# EAGLE design RFM50_to_IWING-MRF_2 (EAGLE 6.5.0)
Shield Board for RFM50 Breakout-Board Making a RFM50 breakout board be compatibled with IWING-MRF board.
AUTHOR: Pasakorn Tiwatthanont
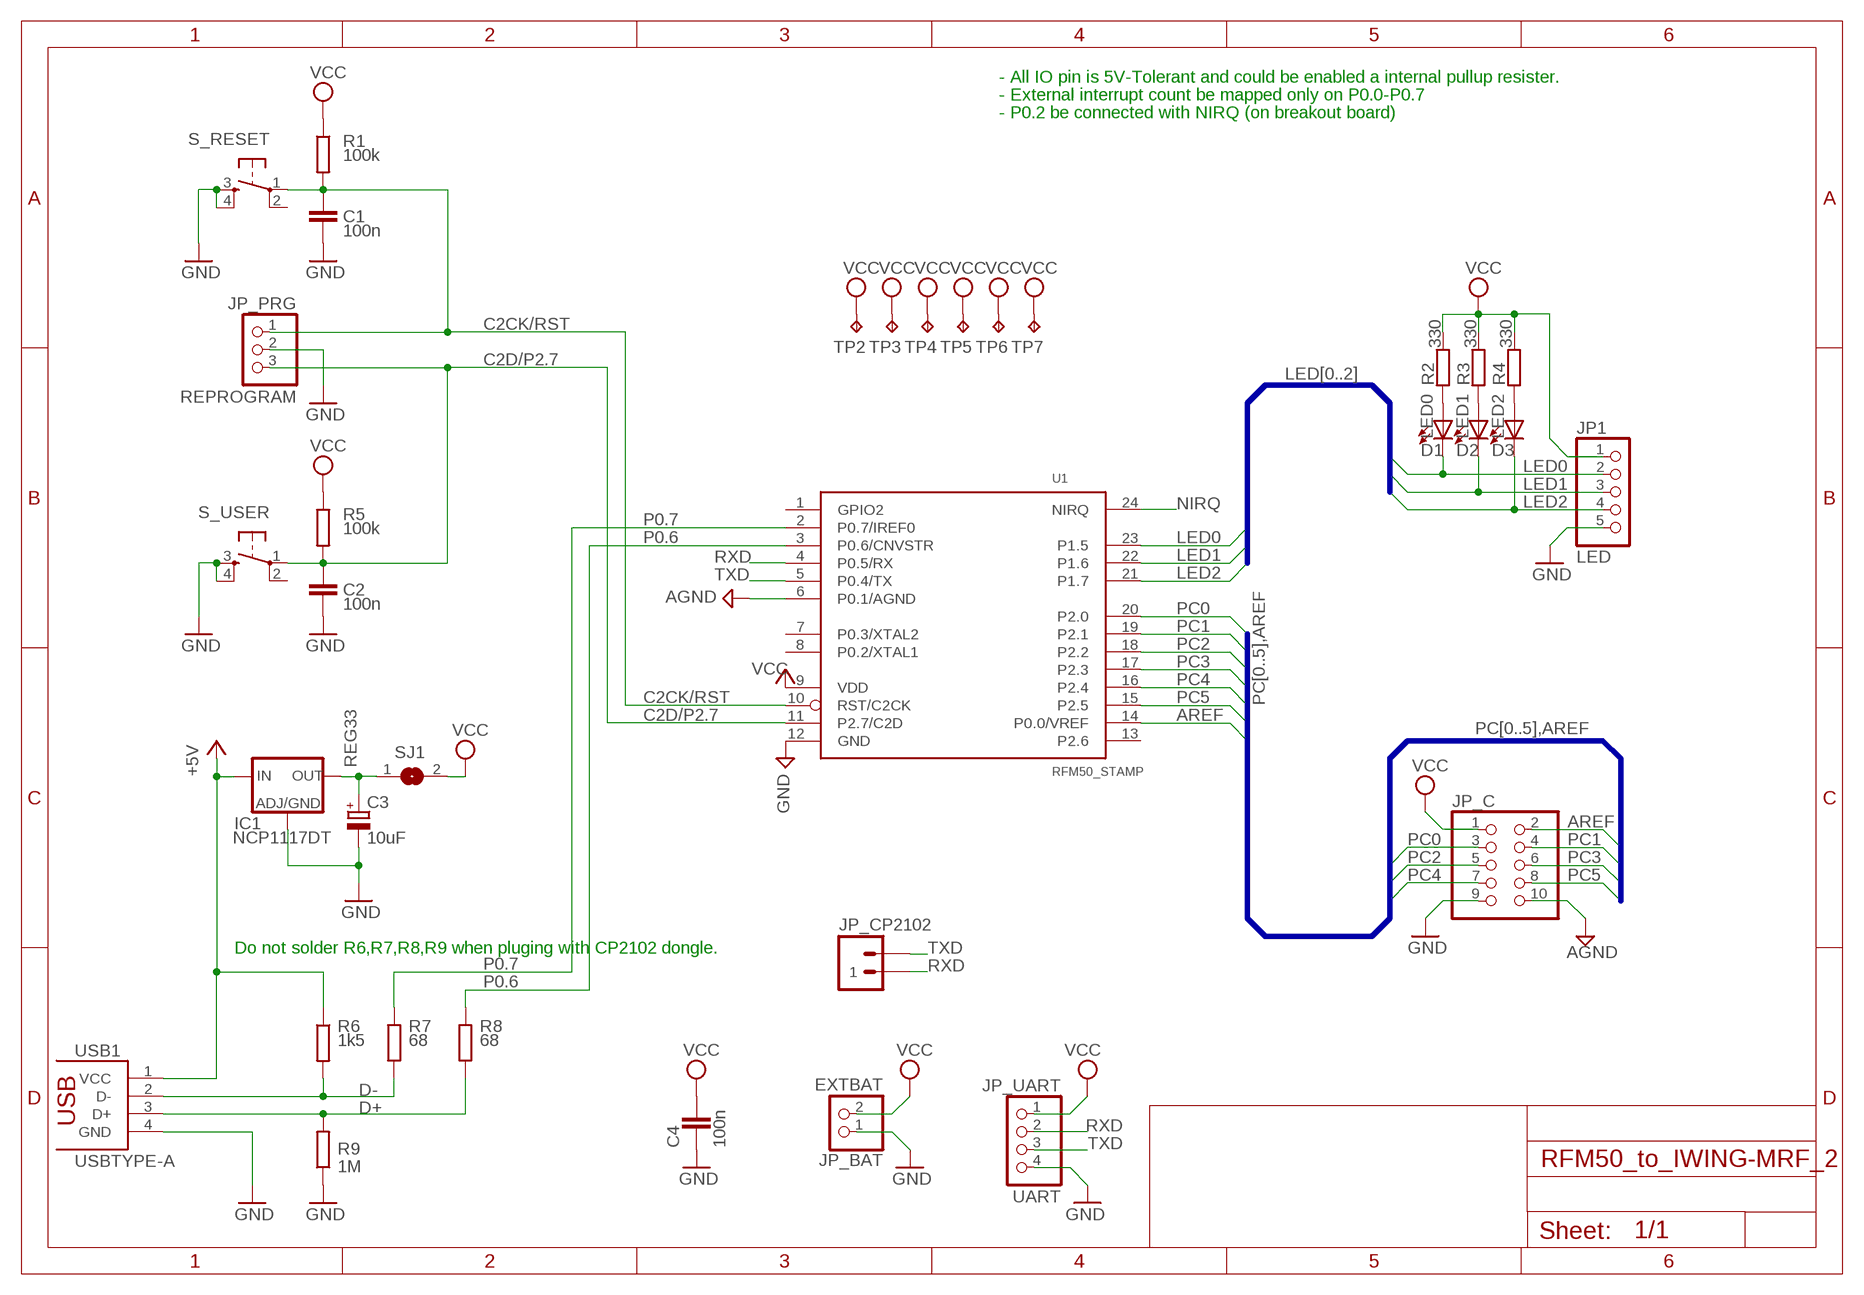
[diagram p0: schematic, sheet 1]

## Parts
C1  100n  C-EU050-024X044  [C050-024X044]
C2  100n  C-EU050-024X044  [C050-024X044]
C3  10uF  CPOL-EUE2,5-6E  [E2,5-6E]
C4  100n  C-EU050-024X044  [C050-024X044]
D1  LED0  LED3MM  [LED3MM]
D2  LED1  LED3MM  [LED3MM]
D3  LED2  LED3MM  [LED3MM]
IC1  NCP1117DT  [DPACK]
JP1  LED  PINHD-1X5  [1X05]
JP_BAT  EXTBAT  PINHD-1X2  [1X02]
JP_C  HEADER-2X5  [2X05]
JP_CP2102  M02PTH  [1X02]
JP_PRG  REPROGRAM  PINHD-1X3  [1X03]
JP_UART  UART  HEADER-1X4ROUND  [1X04_ROUND]
R1  100k  R-EU_0204/5  [0204/5]
R2  330  R-EU_0204/5  [0204/5]
R3  330  R-EU_0204/5  [0204/5]
R4  330  R-EU_0204/5  [0204/5]
R5  100k  R-EU_0204/5  [0204/5]
R6  1k5  R-EU_0204/5  [0204/5]
R7  68  R-EU_0204/5  [0204/5]
R8  68  R-EU_0204/5  [0204/5]
R9  1M  R-EU_0204/5  [0204/5]
S_RESET  DTS-6  [DTS-6]
S_USER  DTS-6  [DTS-6]
SJ1  SOLDERJUMPERREFLOW_NOPASTE  [SOLDERJUMPER_REFLOW_NOPASTE]
TP2  TPPAD1-10  [P1-10_TP]
TP3  TPPAD1-10  [P1-10_TP]
TP4  TPPAD1-10  [P1-10_TP]
TP5  TPPAD1-10  [P1-10_TP]
TP6  TPPAD1-10  [P1-10_TP]
TP7  TPPAD1-10  [P1-10_TP]
U1  RFM50_STAMP  [RFM50_STAMP]
USB1  USBTYPE-A  [USBTYPE-A]

## Nets
+5V: IC1.3(IN) R6.1 USB1.1(VCC)
AGND: JP_C.10 U1.6(P0.1/AGND)
AREF: JP_C.2 U1.14(P0.0/VREF)
C2CK/RST: C1.2 JP_PRG.1 R1.2 S_RESET.1 U1.10(RST/C2CK)
C2D/P2.7: C2.2 JP_PRG.3 R5.2 S_USER.1 U1.11(P2.7/C2D)
D+: R8.1 R9.2 USB1.3(D+)
D-: R6.2 R7.1 USB1.2(D-)
GND [power]: C1.1 C2.1 C3.- C4.1 IC1.1(ADJ) JP1.5 JP_BAT.1 JP_C.9 JP_PRG.2 JP_UART.4 R9.1 S_RESET.3 S_RESET.4 S_USER.3 S_USER.4 U1.12(GND) USB1.4(GND)
LED0: D1.K(C) JP1.2 U1.23(P1.5)
LED1: D2.K(C) JP1.3 U1.22(P1.6)
LED2: D3.K(C) JP1.4 U1.21(P1.7)
N$1: D1.A R2.2
N$7: D2.A R3.2
N$8: D3.A R4.2
NIRQ: U1.24(NIRQ)
P0.6: R8.2 U1.3(P0.6/CNVSTR)
P0.7: R7.2 U1.2(P0.7/IREF0)
PC0: JP_C.3 U1.20(P2.0)
PC1: JP_C.4 U1.19(P2.1)
PC2: JP_C.5 U1.18(P2.2)
PC3: JP_C.6 U1.17(P2.3)
PC4: JP_C.7 U1.16(P2.4)
PC5: JP_C.8 U1.15(P2.5)
REG33 [power]: C3.+ IC1.4(OUT) SJ1.1
RXD: JP_CP2102.1 JP_UART.2 U1.4(P0.5/RX)
TXD: JP_CP2102.2 JP_UART.3 U1.5(P0.4/TX)
VCC [power]: C4.2 JP1.1 JP_BAT.2 JP_C.1 JP_UART.1 R1.1 R2.1 R3.1 R4.1 R5.1 SJ1.2 TP2.TP TP3.TP TP4.TP TP5.TP TP6.TP TP7.TP U1.9(VDD)
Unconnected: S_RESET.2 S_USER.2 U1.1(GPIO2) U1.7(P0.3/XTAL2) U1.8(P0.2/XTAL1) U1.13(P2.6)

## Buses
PC[0..5],AREF
LED[0..2]

## Notes on the sheet
- - All IO pin is 5V-Tolerant and could be enabled a internal pullup resister.
- - External interrupt count be mapped only on P0.0-P0.7
- - P0.2 be connected with NIRQ (on breakout board)
- Do not solder R6,R7,R8,R9 when pluging with CP2102 dongle.

## Library data of the parts
C1 C2 C4 = rcl:C-EU: CAPACITOR, European symbol
C3 = rcl:CPOL-EU: POLARIZED CAPACITOR, European symbol
D1-D3 = led:LED: LED OSRAM: - CHIPLED LG R971, LG N971, LY N971, LG Q971, LY Q971, LO R971, LY R971 LH N974, LH R974 LS Q976, LO Q976, LY Q976 LO Q996 - Hyper CHIPLED LW Q18S LB Q993, LB Q99A, LB R99A - SideLED LS A670, LO A670, LY A670, LG A670, LP A670 LB A673, LV A673, LT A673, LW A673 LH A674 LY A675 LS A676, LA A676, LO A676, LY A676, LW A676 LS A679, LY A679, LG A679 - Hyper Micro SIDELED® LS Y876, LA Y876, LO Y876, LY Y876 LT Y87S - SmartLED LW L88C, LW L88S LB L89C, LB L89S, LG L890 LS L89K, LO L89K, LY L89K LS L896, LA L896, LO L896, LY L896 - TOPLED LS T670, LO T670, LY T670, LG T670, LP T670 LSG T670, LSP T670, LSY T670, LOP T670, LYG T670 LG T671, LOG T671, LSG T671 LB T673, LV T673, LT T673, LW T673 LH T674 LS T676, LA T676, LO T676, LY T676, LB T676, LH T676, LSB T676, LW T676 LB T67C, LV T67C, LT T67C, LS T67K, LO T67K, LY T67K, LW E67C LS E67B, LA E67B, LO E67B, LY E67B, LB E67C, LV E67C, LT E67C LW T67C LS T679, LY T679, LG T679 LS T770, LO T770, LY T770, LG T770, LP T770 LB T773, LV T773, LT T773, LW T773 LH T774 LS E675, LA E675, LY E675, LS T675 LS T776, LA T776, LO T776, LY T776, LB T776 LHGB T686 LT T68C, LB T68C - Hyper Mini TOPLED® LB M676 - Mini TOPLED Santana® LG M470 LS M47K, LO M47K, LY M47K Source: http://www.osram.convergy.de LUXEON: - LUMILED® LXK2-PW12-R00, LXK2-PW12-S00, LXK2-PW14-U00, LXK2-PW14-V00 LXK2-PM12-R00, LXK2-PM12-S00, LXK2-PM14-U00 LXK2-PE12-Q00, LXK2-PE12-R00, LXK2-PE12-S00, LXK2-PE14-T00, LXK2-PE14-U00 LXK2-PB12-K00, LXK2-PB12-L00, LXK2-PB12-M00, LXK2-PB14-N00, LXK2-PB14-P00, LXK2-PB14-Q00 LXK2-PR12-L00, LXK2-PR12-M00, LXK2-PR14-Q00, LXK2-PR14-R00 LXK2-PD12-Q00, LXK2-PD12-R00, LXK2-PD12-S00 LXK2-PH12-R00, LXK2-PH12-S00 LXK2-PL12-P00, LXK2-PL12-Q00, LXK2-PL12-R00 Source: www.luxeon.com KINGBRIGHT: KA-3528ASYC Source: www.kingbright.com
IC1 = iwing-mrf:NCP1117: Low drop-out positive fixed and adjustable voltage regulator
JP1 = ipas:PINHD-1X5: PIN HEADER
JP_BAT = pinhead:PINHD-1X2: PIN HEADER
JP_C = microbuilder:HEADER-2X5: PIN HEADER
JP_CP2102 = ipas:M02: Header 2 Standard 2-pin 0.1" header. Use with straight break away headers (SKU : PRT-00116), right angle break away headers (PRT-00553), swiss pins (PRT-00743), machine pins (PRT-00117), and female headers (PRT-00115). Molex polarized connector foot print use with SKU : PRT-08233 with associated crimp pins and housings.
JP_PRG = pinhead:PINHD-1X3: PIN HEADER
JP_UART = microbuilder:HEADER-1X4: PIN HEADER
R1-R9 = rcl:R-EU_: RESISTOR, European symbol
S_RESET S_USER = switch-tact:DTS-6
SJ1 = ipas:SOLDERJUMPER: SMD Solder JUMPER Solder the two pads together to create a connection, or remove the solder to break it. REFLOW - Use this footprint for solder paste and reflow ovens. WAVE - Use this footprint for hand-soldering (larger pads). CLOSED - Has a trace between the two pads to ensure it is closed by default. The trace needs to be cut to disable the jumper, and can be closed again by creating a solder bridge between the two pads.
TP2-TP7 = ipas:TP: Test pad
U1 = ipas:RFM50_STAMP: RFM50 Stamp Board, placed HopeRF's RFM50, Si1000.
USB1 = USBTYPE-A:USBTYPE-A

## Net classes
0 default: width 0.254 mm, clearance 0.305 mm
1 power: width 0.406 mm, clearance 0.254 mm to class 0, clearance 0.305 mm

## Board
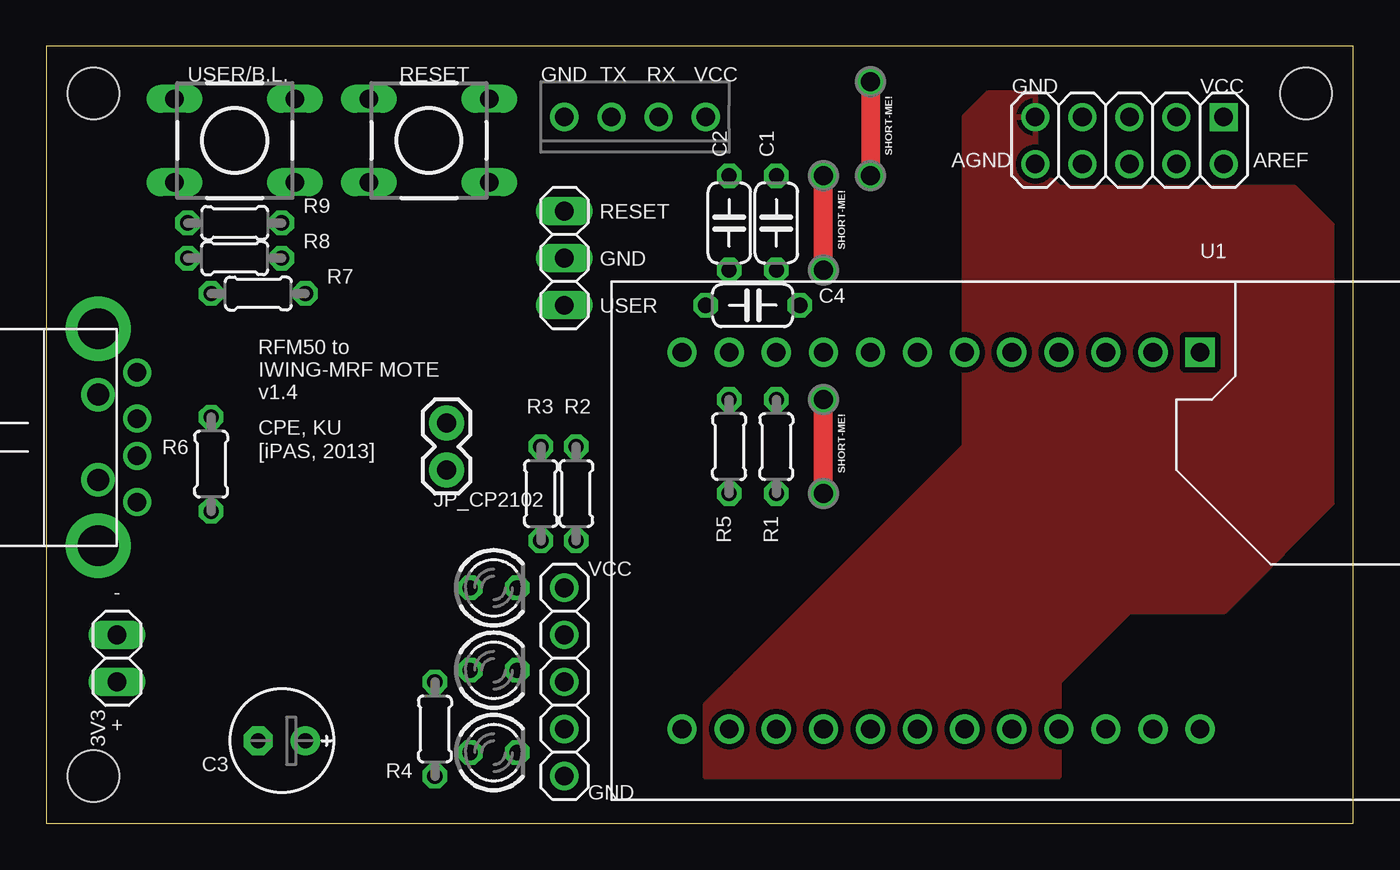
[diagram p1: board, top side]
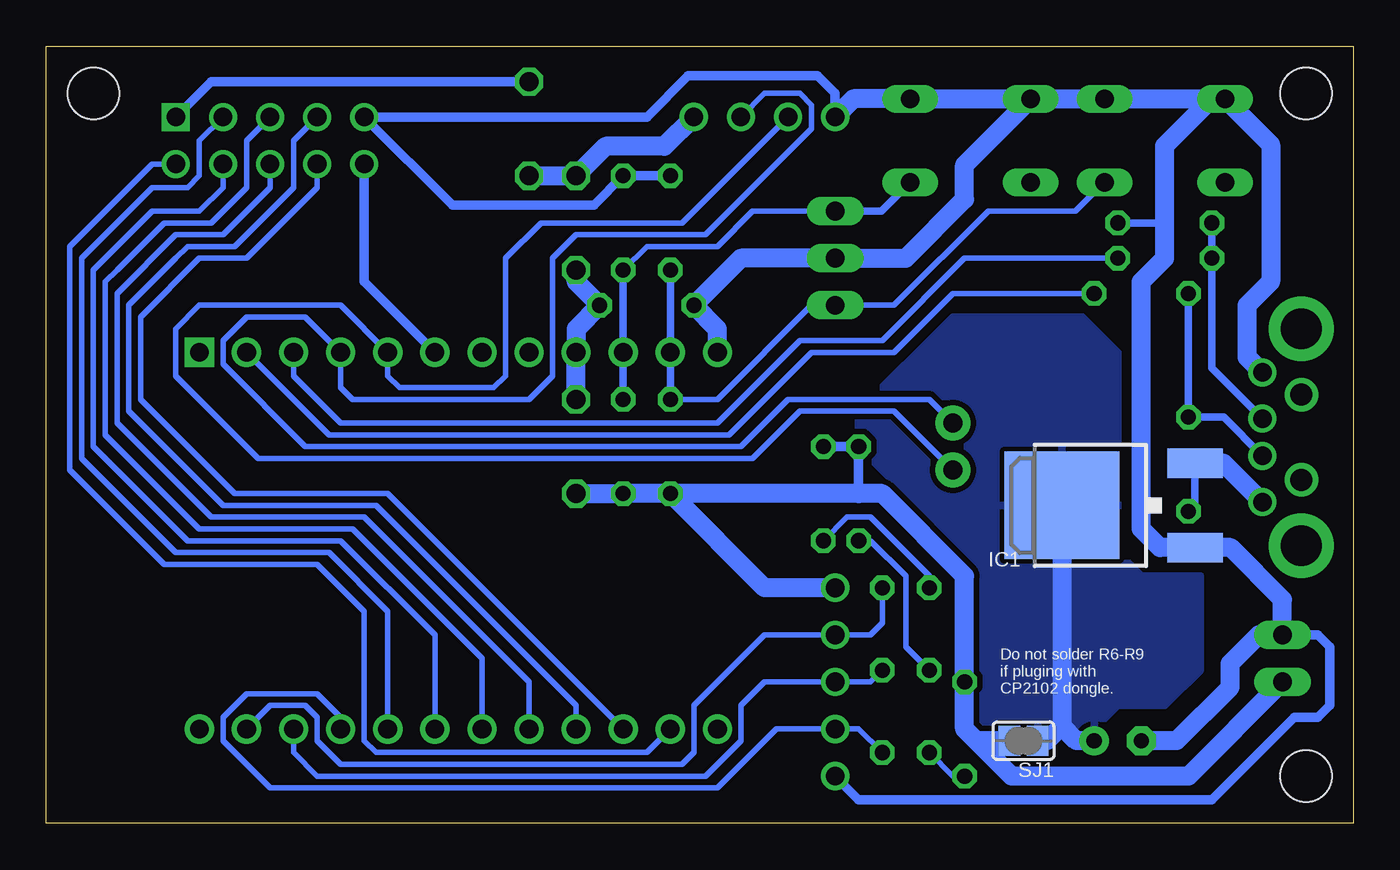
[diagram p2: board, bottom side, seen from below]

Size 70.48 x 41.91 mm. Coordinates in mm from the lower left corner, seen from the top.
Outline: 0,0 70.48,0 70.48,41.91 0,41.91 0,0
Copper layers (1*16): Top 0.035mm / dielectric 1.5mm / Bottom 0.035mm
Design rules "default *": minimum track width 10mil, minimum drill 24mil, track to track 12mil, track to pad 12mil, pad to pad 12mil, via to via 12mil, smd to smd 10mil, copper to edge 40mil, drill to drill 8mil, minimum pad ring 10mil, minimum via ring 8mil, stop-mask expansion 4mil, vias tented up to drill 0mil, thermal gap 10mil
Holes 2.8 mm at 2.54,39.37 2.54,2.54 67.94,39.37

### Footprints (pad centres in the part's own frame; a part is rotated, then mirrored left to right if it is on the bottom)
C050-024X044 = drill 0.813 octagon: 1 -2.54,0; 2 2.54,0
E2,5-6E = drill 0.813 pad 1.575: + -1.27,0 | drill 0.813 pad 1.575 octagon: - 1.27,0
LED3MM = drill 0.813 octagon: A -1.27,0; K 1.27,0
DPACK = smd 1.6 x 3: 1 -2.28,-4.8; 3 2.28,-4.8 | smd 5.8 x 6.2: 4 0,2.38
1X05 = drill 1.016: 1 -5.08,0; 2 -2.54,0; 3 0,0; 4 2.54,0; 5 5.08,0
1X02 = drill 1.016 long: 1 -1.27,0; 2 1.27,0
2X05 = drill 1 square: 1 -5.08,-1.27 | drill 1: 2 -5.08,1.27; 3 -2.54,-1.27; 4 -2.54,1.27; 5 0,-1.27; 6 0,1.27; 7 2.54,-1.27; 8 2.54,1.27; 9 5.08,-1.27; 10 5.08,1.27
1X02' = drill 1.016 pad 1.88: 1 0,0; 2 2.54,0
1X03 = drill 1.016 long: 1 -2.54,0; 2 0,0; 3 2.54,0
1X04_ROUND = drill 1 pad 1.524: 1 -3.81,0; 2 -1.27,0; 3 1.27,0; 4 3.81,0
0204/5 = drill 0.813 octagon: 1 -2.54,0; 2 2.54,0
DTS-6 = drill 1 long: 1 -3.25,2.25; 2 3.25,2.25; 3 -3.25,-2.25; 4 3.25,-2.25
SOLDERJUMPER_REFLOW_NOPASTE = smd 1.168 x 1.6: 1 -0.762,0; 2 0.762,0
P1-10_TP = drill 1.016 octagon: TP 0,0
RFM50_STAMP = drill 1.016 pad 1.575 square: 1 0,27.94 | drill 1.016 pad 1.575: 2 0,25.4; 3 0,22.86; 4 0,20.32; 5 0,17.78; 6 0,15.24; 7 0,12.7; 8 0,10.16; 9 0,7.62; 10 0,5.08; 11 0,2.54; 12 0,0; 13 20.32,0; 14 20.32,2.54; 15 20.32,5.08; 16 20.32,7.62; 17 20.32,10.16; 18 20.32,12.7; 19 20.32,15.24; 20 20.32,17.78; 21 20.32,20.32; 22 20.32,22.86; 23 20.32,25.4; 24 20.32,27.94
USBTYPE-A = drill 1: 1 -2.1,9.35; 2 -2.1,6.85; 3 -2.1,4.85; 4 -2.1,2.35 | drill 2.2 pad 3.5: GND@1 0,0; GND@2 0,11.7 | drill 1.2 pad 1.6: S1 0,3.55; S2 0,8.15

### Placement (x,y rotation side)
C1  39.37,32.38 270 top
C2  36.83,32.38 270 top
C3  12.7,4.45 180 top
C4  38.1,27.94 0 top
D1  24.13,12.7 0 top
D2  24.13,8.26 0 top
D3  24.13,3.81 0 top
IC1  13.34,17.14 90 bottom
JP1  27.94,7.62 270 top
JP_BAT  3.81,8.89 270 top
JP_C  58.42,36.83 180 top
JP_CP2102  [1X02']  21.59,21.59 270 top
JP_PRG  27.94,30.48 270 top
JP_UART  31.75,38.1 180 top
R1  39.37,20.32 90 top
R2  28.57,17.78 270 top
R3  26.67,17.78 270 top
R4  20.95,5.08 270 top
R5  36.83,20.32 90 top
R6  8.89,19.37 90 top
R7  11.43,28.57 0 top
R8  10.16,30.48 0 top
R9  10.16,32.38 180 top
S_RESET  20.64,36.83 180 top
S_USER  10.16,36.83 180 top
SJ1  17.78,4.45 180 bottom
TP2  41.91,17.78 0 top
TP3  41.91,22.86 0 top
TP4  41.91,29.84 0 top
TP5  41.91,34.92 0 top
TP6  44.45,34.92 0 top
TP7  44.45,40.01 0 top
U1  34.29,25.4 270 top
USB1  2.79,26.67 180 top

### Tracks (layer width: path | path; a pad name or v marks a point on that pad's centre or on a via)
+5V
  Bottom 0.406: IC1.3 8.54,17.18 R6.1
  Bottom 1.016: USB1.1 7,19.43 IC1.3
AGND
  Bottom 0.508: U1.6 53.34,29.21 JP_C.10
AREF
  Bottom 0.305: U1.14 38.1,3.81 52.7,3.81 53.34,4.45 53.34,11.43 55.88,13.97 64.14,13.97 69.22,19.05 69.22,31.11 64.77,35.56 JP_C.2
C2CK/RST
  Bottom 0.305: JP_PRG.1 32.38,33.02 34.29,31.11 38.1,31.11 C1.2
  Bottom 0.406: JP_PRG.1 25.45,33.02 S_RESET.1 | C1.2 U1.10 R1.2
C2D/P2.7
  Bottom 0.305: R5.2 34.29,22.86 29.21,27.94 JP_PRG.3 24.77,27.94 19.68,33.02 14.97,33.02 S_USER.1
  Bottom 0.406: C2.2 U1.11 R5.2
D+
  Bottom 0.406: USB1.3 7.62,24.55 R8.1 R9.2
D-
  Bottom 0.406: USB1.2 6.98,21.91 R6.2 R7.1
GND
  Bottom 0.406: R9.1 10.16,32.38 10.16,33.02
  Bottom 0.508: C2.1 C1.1 40.96,33.34 48.58,33.34 JP_C.9 38.1,38.1 35.88,40.32 28.89,40.32 27.94,39.37 JP_UART.4 | JP_BAT.1 1.91,10.16 1.27,9.53 1.27,6.35 1.91,5.71 3.17,5.71 7.62,1.27 26.67,1.27 JP1.5
  Bottom 1.016: S_RESET.4 S_USER.3 7.62,39.08 | 7.62,39.08 S_USER.4 4.45,36.62 4.45,29.21 5.71,27.94 5.71,25.14 USB1.4 | JP_UART.4 26.96,39.08 S_RESET.3 S_RESET.4 | 7.62,39.08 10.16,36.54 10.16,33.02 10.16,30.48 11.43,29.21 11.43,15.88 10.42,14.87 IC1.1 6.61,14.87 3.81,12.06 JP_BAT.1 5.08,10.16 6.63,8.61 6.63,7.34 9.53,4.45 C3.- | U1.12 34.29,26.67 C4.1 33.02,30.48 JP_PRG.2 24.13,30.48 20.95,33.66 20.95,35.51 S_RESET.4
  pour Top: 49.53,38.1 49.53,20.32 35.56,6.35 35.56,2.54 54.61,2.54 54.61,7.62 58.42,11.43 63.5,11.43 69.85,17.78 69.85,31.75 67.31,34.29 54.61,34.29 53.34,35.56 53.34,39.37 50.8,39.37
LED0
  Bottom 0.305: U1.23 58.42,6.35 56.52,6.35 55.88,5.71 55.88,4.45 54.61,3.17 36.2,3.17 35.56,3.81 35.56,6.35 31.75,10.16 JP1.2 26.04,10.16 25.4,10.79 D1.K
LED1
  Bottom 0.305: U1.22 57.15,3.81 55.88,2.54 34.92,2.54 33.02,4.45 33.02,6.35 31.75,7.62 JP1.3 26.04,7.62 D2.K
LED2
  Bottom 0.305: U1.21 54.61,5.71 55.88,6.99 59.69,6.99 60.96,5.71 60.96,4.45 58.42,1.91 34.29,1.91 31.11,5.08 JP1.4 26.67,5.08 D3.K
N$1
  Bottom 0.305: D1.A 22.86,13.34 26.04,16.51 27.3,16.51 R2.2
N$7
  Bottom 0.305: D2.A 24.13,9.53 24.13,13.34 26.04,15.24 R3.2
N$8
  Bottom 0.305: R4.2 21.59,2.54 D3.A
P0.6
  Bottom 0.305: U1.3 57.15,24.13 54.61,21.59 34.29,21.59 29.84,26.04 25.4,26.04 20.95,30.48 R8.2
P0.7
  Bottom 0.305: U1.2 55.24,20.95 33.66,20.95 29.21,25.4 24.77,25.4 21.59,28.57 R7.2
PC0
  Bottom 0.305: JP_C.3 62.23,36.83 62.23,34.92 62.87,34.29 63.5,34.29 64.77,34.29 68.58,30.48 68.58,29.21 68.58,19.68 63.5,14.61 55.24,14.61 52.07,11.43 U1.20
PC1
  Bottom 0.305: U1.19 49.53,10.16 54.61,15.24 62.87,15.24 67.94,20.32 67.94,28.57 67.94,29.84 64.77,33.02 63.5,33.02 62.23,33.02 60.96,34.29 JP_C.4
PC2
  Bottom 0.305: JP_C.5 59.69,36.83 59.69,34.29 61.59,32.38 62.87,32.38 64.14,32.38 66.67,29.84 67.31,29.21 67.31,27.94 67.31,20.95 62.23,15.88 53.98,15.88 46.99,8.89 U1.18
PC3
  Bottom 0.305: U1.17 44.45,7.62 53.34,16.51 61.59,16.51 66.67,21.59 66.67,27.3 66.67,28.57 63.5,31.75 62.23,31.75 60.96,31.75 58.42,34.29 JP_C.6
PC4
  Bottom 0.305: JP_C.7 57.15,36.83 57.15,34.29 60.33,31.11 61.59,31.11 62.87,31.11 63.5,30.48 66.04,27.94 66.04,26.67 66.04,22.23 60.96,17.14 52.7,17.14 41.91,6.35 U1.16
PC5
  Bottom 0.305: U1.15 52.07,17.78 60.33,17.78 65.41,22.86 65.41,27.3 62.23,30.48 59.69,30.48 55.88,34.29 JP_C.8
REG33
  Bottom 1.016: C3.+ 14.92,4.45 15.71,5.24 | SJ1.1 16.51,4.45 15.71,5.24 | IC1.4 15.71,5.24
  pour Bottom: 20.32,5.08 13.97,5.08 12.7,6.35 10.16,6.35 8.26,8.26 8.26,13.34 11.43,13.34 12.7,14.61 12.7,25.4 14.61,27.3 21.59,27.3 26.67,22.23 26.67,20.32 20.32,13.97
RXD
  Bottom 0.305: JP_UART.2 31.75,39.37 29.84,39.37 29.21,38.73 29.21,37.47 34.92,31.75 41.91,31.75 43.18,30.48 43.18,24.13 44.45,22.86 53.98,22.86 54.61,23.5 U1.4 56.52,27.3 59.69,27.3 60.96,26.04 60.96,24.77 56.52,20.32 33.02,20.32 30.48,22.86 22.86,22.86 JP_CP2102.1
TXD
  Bottom 0.305: JP_UART.3 36.2,32.38 43.81,32.38 45.72,30.48 45.72,24.13 46.35,23.5 51.44,23.5 52.07,24.13 U1.5 54.61,27.94 62.23,27.94 63.5,26.67 63.5,24.13 59.05,19.68 32.38,19.68 29.84,22.23 24.77,22.23 JP_CP2102.2
VCC
  Top 1.016: TP2.TP TP3.TP | TP4.TP TP5.TP | TP7.TP TP6.TP
  Bottom 0.508: JP_C.1 61.59,40.01 TP7.TP | 26.67,17.78 R3.1 R2.1
  Bottom 1.016: R5.1 R1.1 TP2.TP | TP3.TP U1.9 41.91,26.67 C4.2 41.91,29.21 TP4.TP | JP_BAT.2 8.89,2.54 18.41,2.54 20.32,4.45 | JP_UART.1 37.15,36.51 40.32,36.51 TP5.TP TP6.TP | SJ1.2 20.32,4.45 | 20.32,4.45 20.95,5.08 R4.1 20.95,13.34 25.4,17.78 26.67,17.78 R5.1 | JP1.1 31.75,12.7 R5.1

### Text on the board
tPlace: USER/B.L. | RESET | GND | TX | RX | VCC | SHORT-ME! | GND | VCC | AGND | AREF | SHORT-ME! | RESET | GND | USER | RFM50 to / IWING-MRF MOTE / v1.4 | SHORT-ME! | CPE, KU | [iPAS, 2013] | VCC | - | + | 3V3 | GND
bPlace: Do not solder R6-R9 / if pluging with / CP2102 dongle.
tValues: PERIPHERALS-C | PERIPHERALS-D